# Altium schematic sheet RX_RUBVERANO.SchDoc
size A3; SheetNumber: 22; SheetTotal: 25
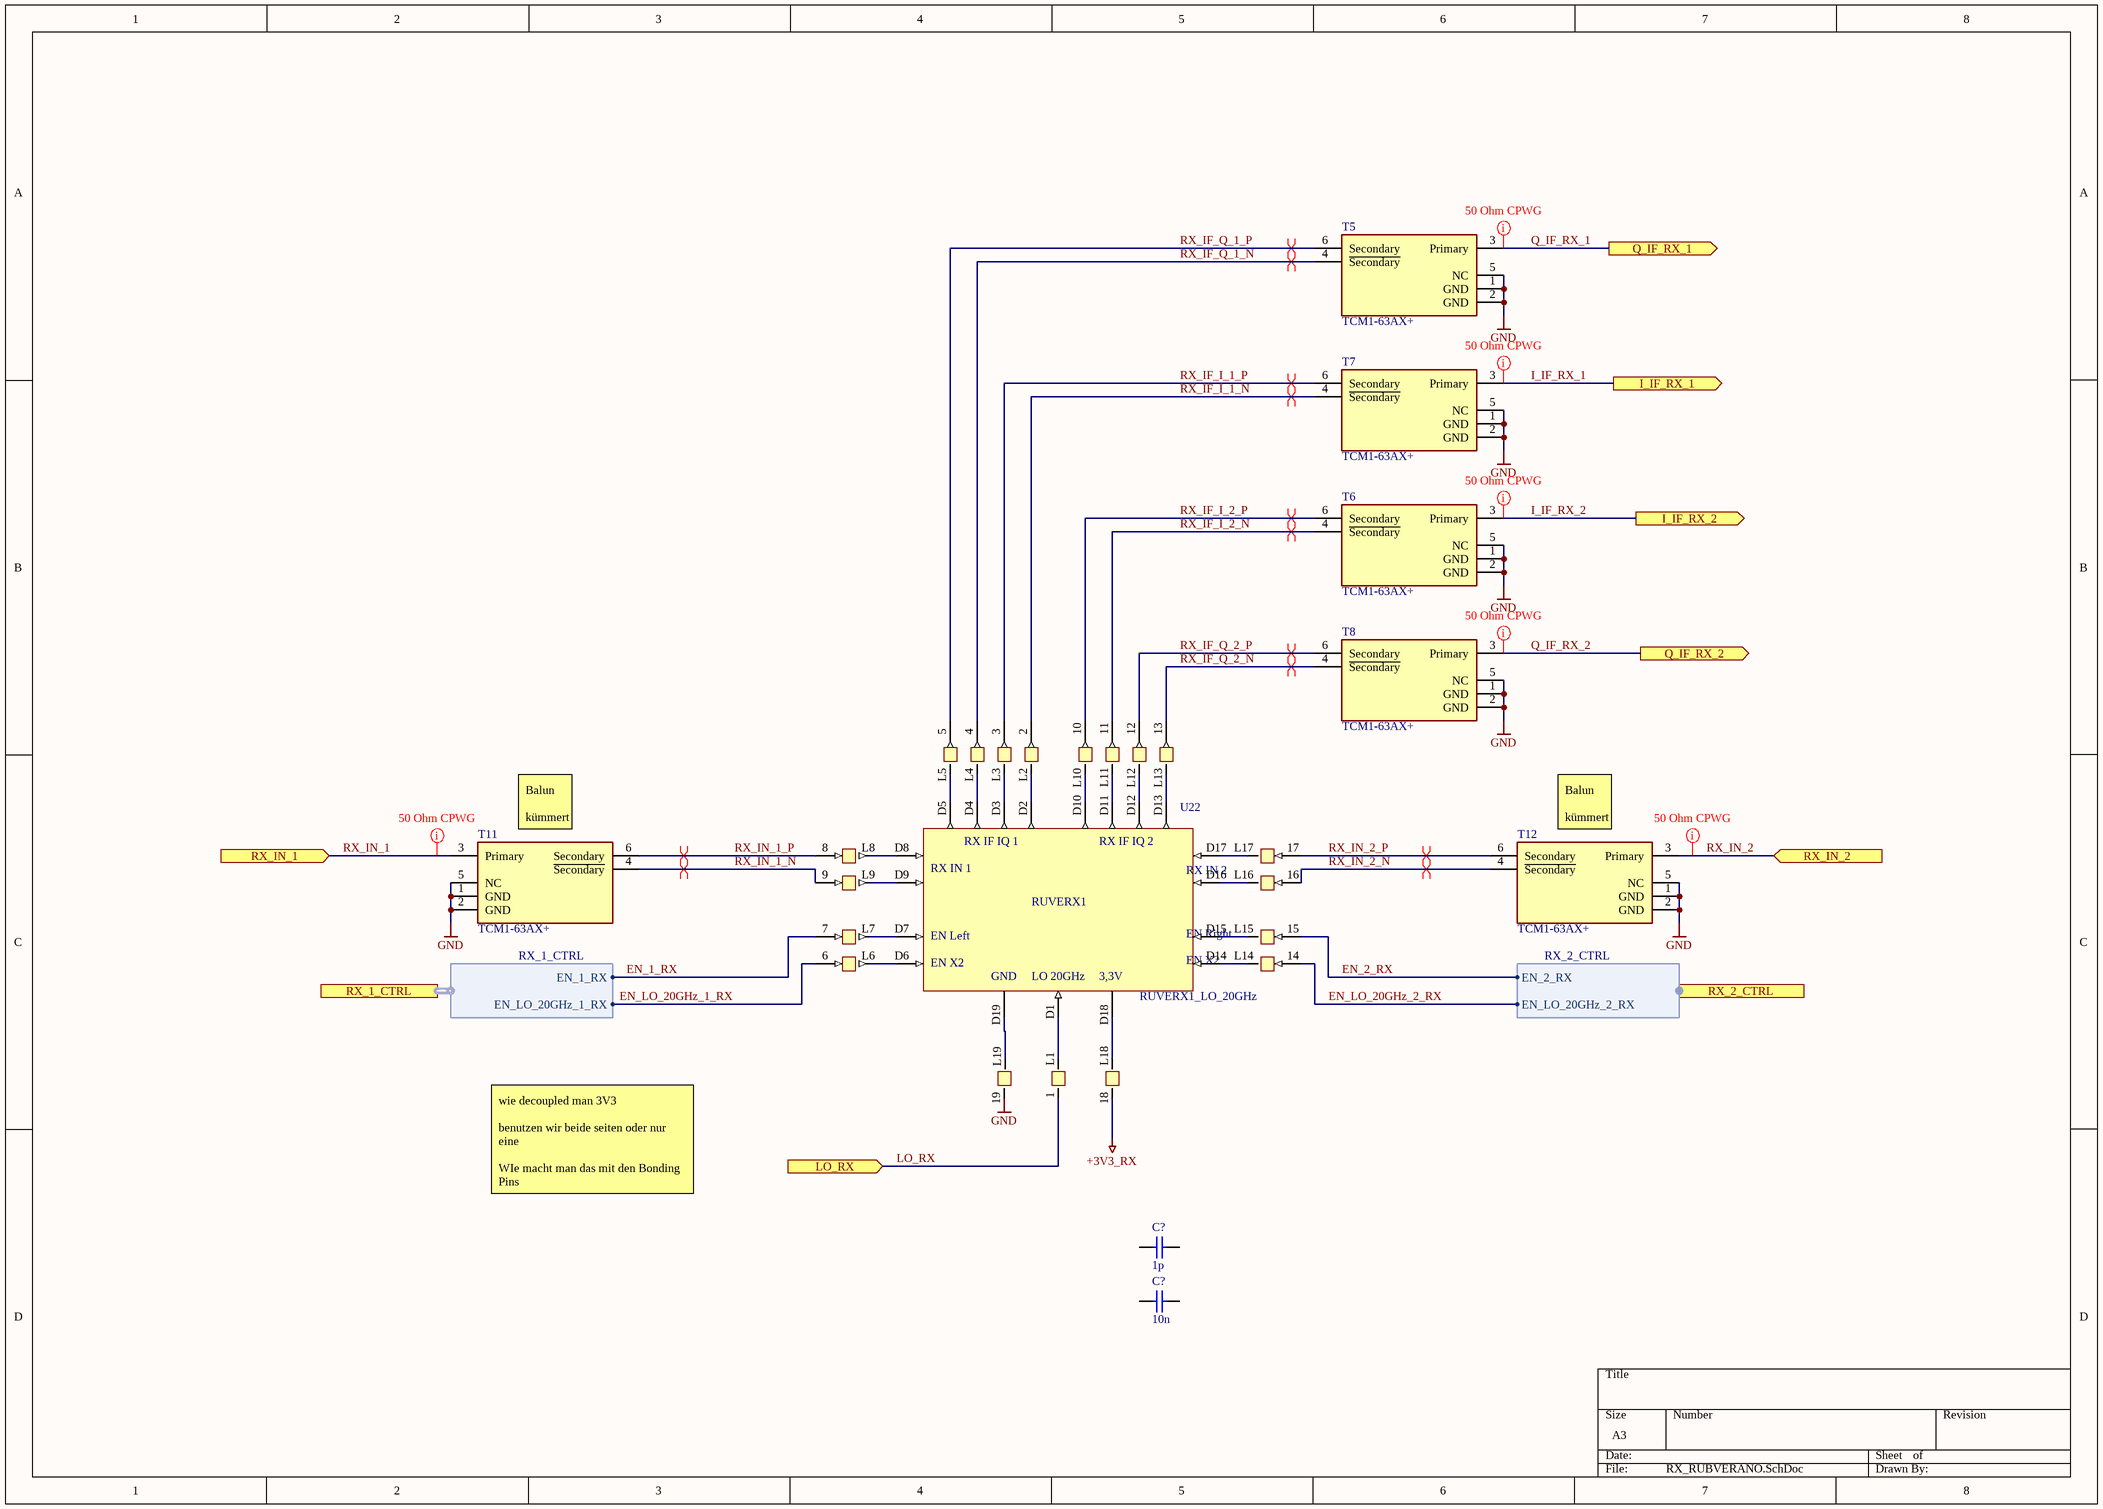
[diagram p0: RX_RUBVERANO.SchDoc]

## Parts
(Parts that share a designator on the sheet are numbered #1, #2 ... from top to bottom, then left to right.)
C?#1  1p  [C_0402_1005Metric_IPC_N]
C?#2  10n  [C_0402_1005Metric_IPC_N]
T5  TCM1-63AX+  [DB1627]
T6  TCM1-63AX+  [DB1627]
T7  TCM1-63AX+  [DB1627]
T8  TCM1-63AX+  [DB1627]
T11  TCM1-63AX+  [DB1627]
T12  TCM1-63AX+  [DB1627]
U22  RUVERX1_LO_20GHz  [RUVERX1_LO_20GHz]

## Ports
I_IF_RX_1 (out, see Top_Level[7B], IF_Connectors[2A]), I_IF_RX_2 (out, see Top_Level[7B], IF_Connectors[2A]), LO_RX (in, see Top_Level[6B]), Q_IF_RX_1 (out, see Top_Level[7B], IF_Connectors[2B]), Q_IF_RX_2 (out, see Top_Level[7C], IF_Connectors[2B]), RX_1_CTRL (harness RX_1_CTRL, see Top_Level[6C], MCU[5C]), RX_2_CTRL (harness RX_2_CTRL, see Top_Level[6C], MCU[5C]), RX_IN_1 (in, see Top_Level[7C], GSG_RX[2B]), RX_IN_2 (in, see Top_Level[7C], GSG_RX[2B])

## Harnesses
RX_2_CTRL: EN_LO_20GHz_2_RX, EN_2_RX
RX_1_CTRL: EN_LO_20GHz_1_RX, EN_1_RX

## Nets
+3V3_RX: U22.18
GND: T5.1(GND) T5.2(GND) T5.5(NC) T6.1(GND) T6.2(GND) T6.5(NC) T7.1(GND) T7.2(GND) T7.5(NC) T8.1(GND) T8.2(GND) T8.5(NC) T11.1(GND) T11.2(GND) T11.5(NC) T12.1(GND) T12.2(GND) T12.5(NC) U22.19
EN_1_RX: U22.7 ; port RX_1_CTRL.EN_1_RX
EN_2_RX: U22.15 ; port RX_2_CTRL.EN_2_RX
EN_LO_20GHz_1_RX: U22.6 ; port RX_1_CTRL.EN_LO_20GHz_1_RX
EN_LO_20GHz_2_RX: U22.14 ; port RX_2_CTRL.EN_LO_20GHz_2_RX
I_IF_RX_1: T7.3(Primary) ; port I_IF_RX_1
I_IF_RX_2: T6.3(Primary) ; port I_IF_RX_2
LO_RX: U22.1 ; port LO_RX
Q_IF_RX_1: T5.3(Primary) ; port Q_IF_RX_1
Q_IF_RX_2: T8.3(Primary) ; port Q_IF_RX_2
RX_IF_I_1_N: T7.4(~{Secondary}) U22.2
RX_IF_I_1_P: T7.6(Secondary) U22.3
RX_IF_I_2_N: T6.4(~{Secondary}) U22.11
RX_IF_I_2_P: T6.6(Secondary) U22.10
RX_IF_Q_1_N: T5.4(~{Secondary}) U22.4
RX_IF_Q_1_P: T5.6(Secondary) U22.5
RX_IF_Q_2_N: T8.4(~{Secondary}) U22.13
RX_IF_Q_2_P: T8.6(Secondary) U22.12
RX_IN_1: T11.3(Primary) ; port RX_IN_1
RX_IN_1_N: T11.4(~{Secondary}) U22.9
RX_IN_1_P: T11.6(Secondary) U22.8
RX_IN_2: T12.3(Primary) ; port RX_IN_2
RX_IN_2_N: T12.4(~{Secondary}) U22.16
RX_IN_2_P: T12.6(Secondary) U22.17
NetU22_D1: U22.D1 U22.L1
NetU22_D2: U22.D2 U22.L2
NetU22_D3: U22.D3 U22.L3
NetU22_D4: U22.D4 U22.L4
NetU22_D5: U22.D5 U22.L5
NetU22_D6: U22.D6 U22.L6
NetU22_D7: U22.D7 U22.L7
NetU22_D8: U22.D8 U22.L8
NetU22_D9: U22.D9 U22.L9
NetU22_D10: U22.D10 U22.L10
NetU22_D11: U22.D11 U22.L11
NetU22_D12: U22.D12 U22.L12
NetU22_D13: U22.D13 U22.L13
NetU22_D14: U22.D14 U22.L14
NetU22_D15: U22.D15 U22.L15
NetU22_D16: U22.D16 U22.L16
NetU22_D17: U22.D17 U22.L17
NetU22_D18: U22.D18 U22.L18
NetU22_D19: U22.D19 U22.L19

Not connected (* = marked no-connect by the designer): C?#1 1 2; C?#2 1 2

## Layout directives
differential pair: RX_IF_I_1_N, RX_IF_I_1_P, RX_IF_I_2_N, RX_IF_I_2_P, RX_IF_Q_1_N, RX_IF_Q_1_P, RX_IF_Q_2_N, RX_IF_Q_2_P, RX_IN_1_N, RX_IN_1_P, RX_IN_2_N, RX_IN_2_P
net class 50Ohm_CPWG: I_IF_RX_1, I_IF_RX_2, Q_IF_RX_1, Q_IF_RX_2, RX_IN_1, RX_IN_2

## Notes on the sheet
- (near T11) Balun
  kümmert sich Tobi drum
- (near T12) Balun
  kümmert sich Tobi drum
- wie decoupled man 3V3
  benutzen wir beide seiten oder nur eine
  WIe macht man das mit den Bonding Pins
- (in symbol RF000013) RX IF IQ 1; RX IF IQ 2; RX IN 1; RX IN 2; RUVERX1; EN Left; EN Right; EN X2; GND; LO 20GHz; 3,3V

## Library data of the parts
C?#1 C?#2 = C000002: Generic MLCC with 0402 Footprint; Specific Component: False; ID: C000002; Tolerance: *; Temp Coefficient: *; Voltage Rated: *; min Temperature: *; max Temperature: *; Case: 0402
  C?#1: Capacitance: 1p
  C?#2: Capacitance: 10n
T5-T8 T11 T12 = RF000014: Manufacturer: Minicircuits; Type: Balun; ID: RF000014; Manufacturer Part Number: TCM1-63AX+; Part Value: TCM1-63AX+; Case: DB1627; ComponentLink1Description: Datasheet; ComponentLink1URL: https://www.minicircuits.com/pdfs/TCM1-63AX+.pdf; Supplier 1: Mouser; Supplier Part Number 1: 139-TCM1-63AX; Supplier 2: Digikey; Supplier Part Number 2: 3157-TCM1-63AX+CT-ND
U22 = RF000013: RUVETX1 LO-Eingang bei 20 GHz; Manufacturer: RUB; ID: RF000013; Type: Radar Receiver; Manufacturer Part Number: RUVERX1_LO_20GHz; Part Value: RUVERX1_LO_20GHz; Case: custom